# EAGLE design HshMain_v1.2 (EAGLE 7.4.0)
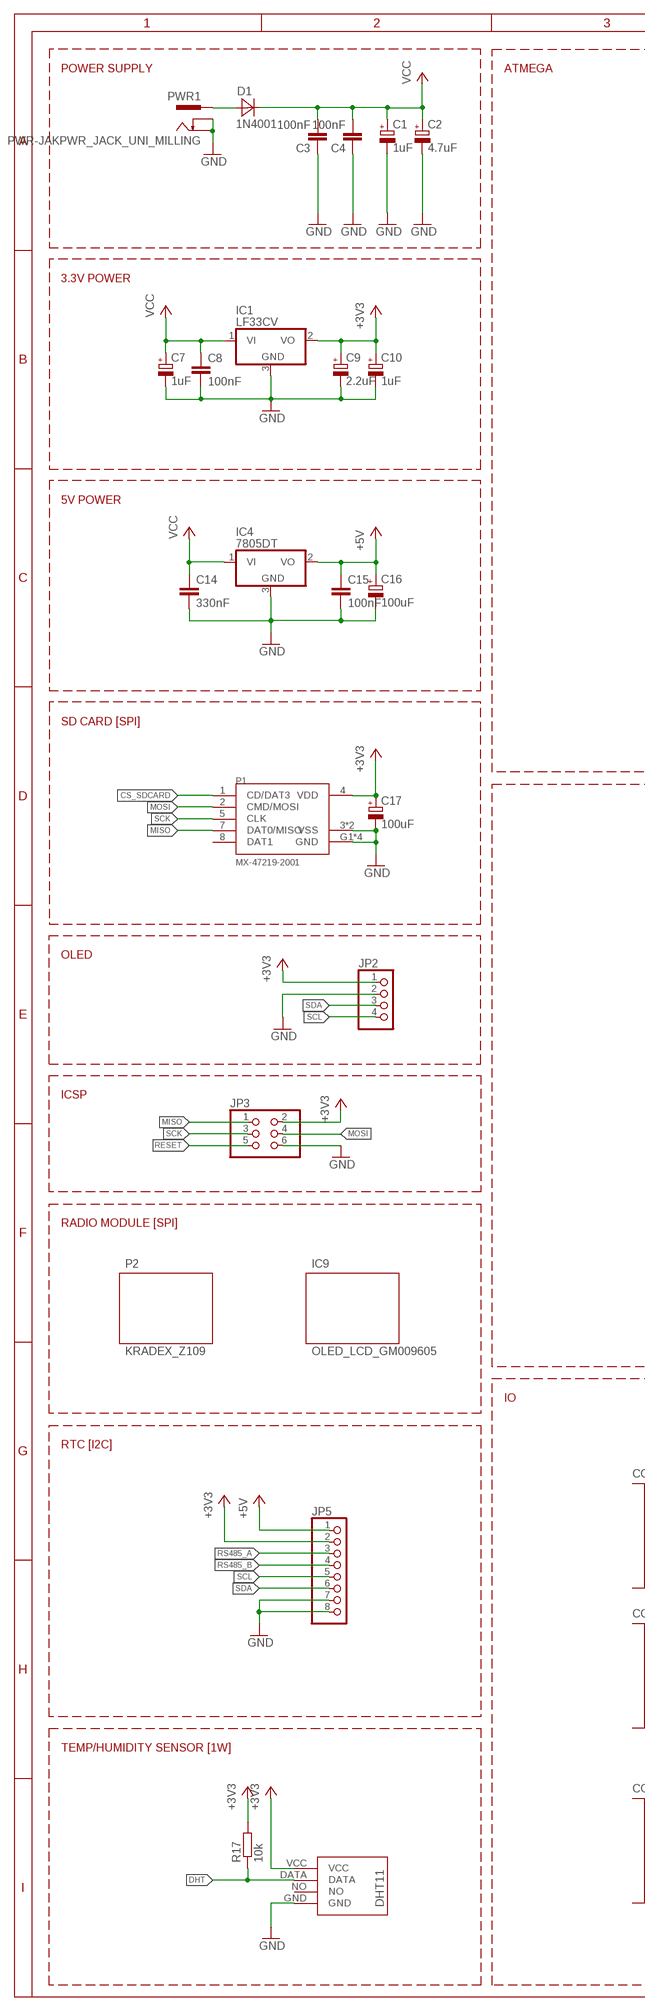
[diagram p0: schematic, sheet 1, part 1 of 2]
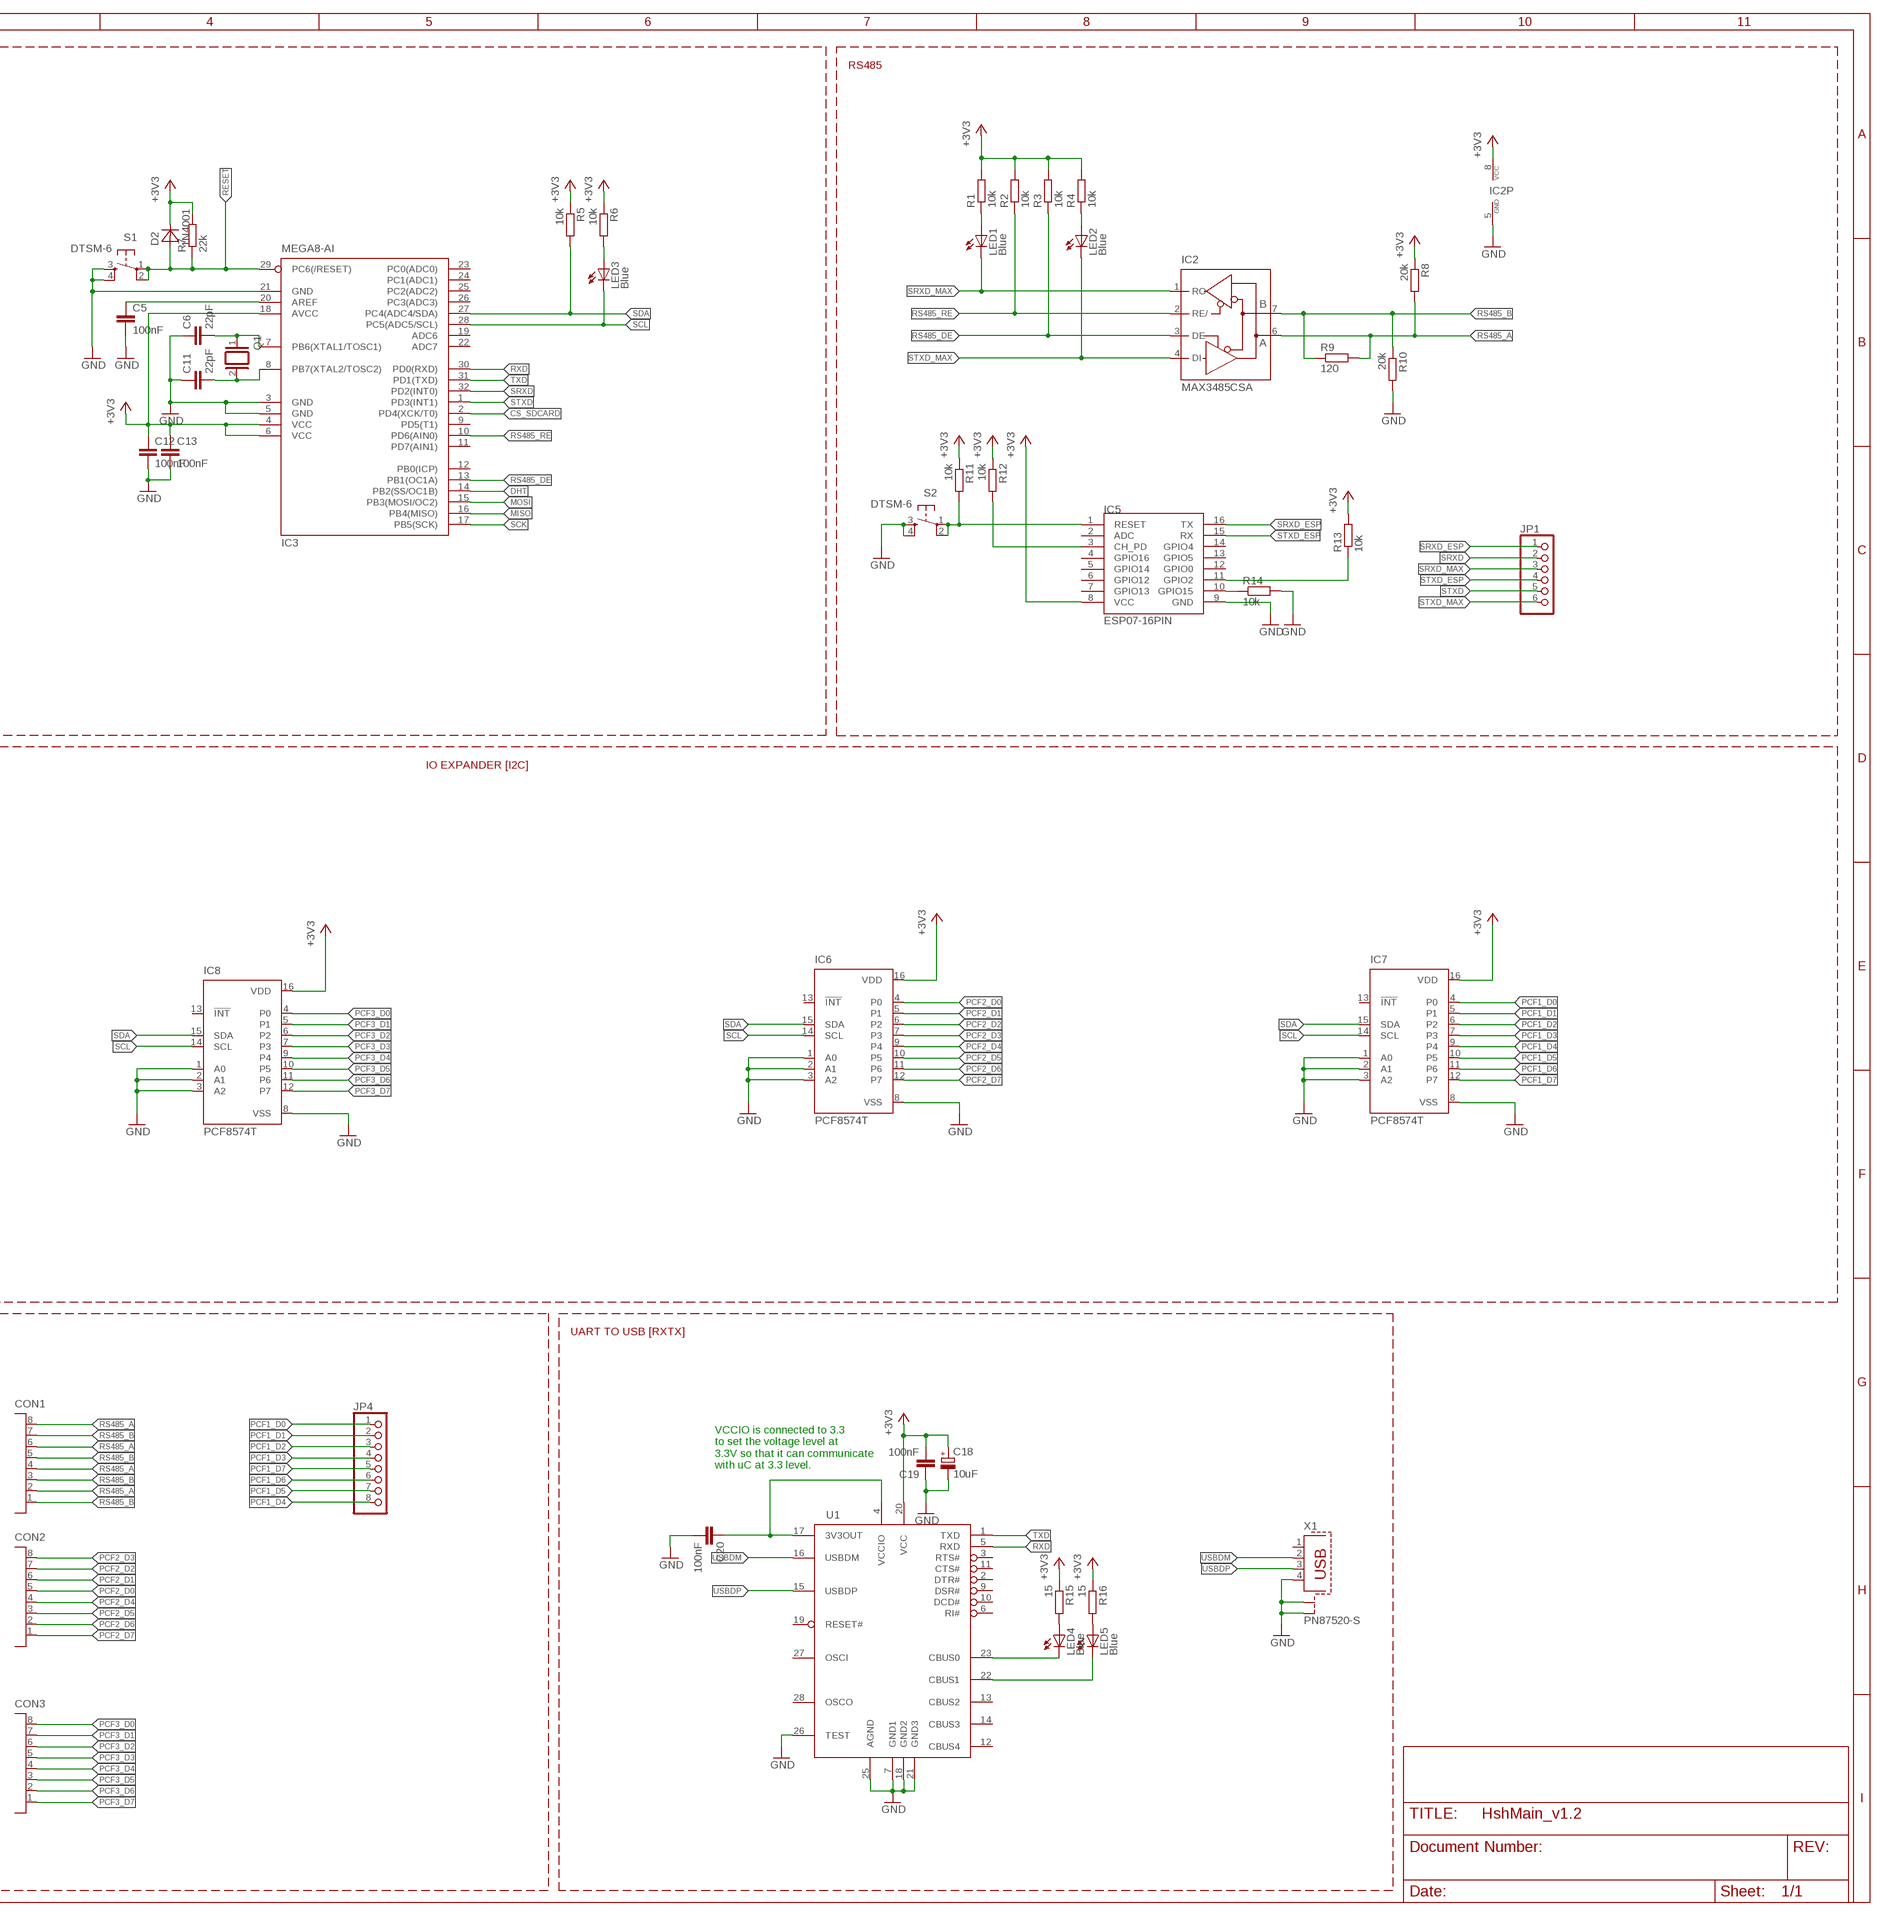
[diagram p1: schematic, sheet 1, part 2 of 2]

## Parts
C1  1uF  CPOL-EUB  [PANASONIC_B]
C2  4.7uF  CPOL-EUB  [PANASONIC_B]
C3  100nF  C-EUC0805  [C0805]
C4  100nF  C-EUC0805  [C0805]
C5  100nF  C-EUC0805  [C0805]
C6  22pF  C-EUC0805  [C0805]
C7  1uF  CPOL-EUB  [PANASONIC_B]
C8  100nF  C-EUC0805  [C0805]
C9  2.2uF  CPOL-EUB  [PANASONIC_B]
C10  1uF  CPOL-EUB  [PANASONIC_B]
C11  22pF  C-EUC0805  [C0805]
C12  100nF  C-EUC0805  [C0805]
C13  100nF  C-EUC0805  [C0805]
C14  330nF  C-EUC0805  [C0805]
C15  100nF  C-EUC0805  [C0805]
C16  100uF  CPOL-EUD  [PANASONIC_D]
C17  100uF  CPOL-EUD  [PANASONIC_D]
C18  10uF  CPOL-EUB  [PANASONIC_B]
C19  100nF  C-EUC0805  [C0805]
C20  100nF  C-EUC0805  [C0805]
CON1  15EDGRC-3.81-8P  [15EDGRC-3.81-8P]
CON2  15EDGRC-3.81-8P  [15EDGRC-3.81-8P]
CON3  15EDGRC-3.81-8P  [15EDGRC-3.81-8P]
D1  1N4001  MBRA340T3  [SMA]
D2  1N4001  MBRA340T3  [SMA]
IC1  LF33CV  78DT  [TO252]
IC2  MAX3485CSA  MAX481CSA  [SO08]
IC3  MEGA8-AI  [TQFP32-08]
IC4  7805DT  [TO252]
IC5  ESP07-16PIN  [ESP07-16PIN]
IC6  PCF8574T  [SO16W]
IC7  PCF8574T  [SO16W]
IC8  PCF8574T  [SO16W]
IC9  OLED_LCD_GM009605  [OLED_LCD_GM009605]
IC10  DHT11-PION.  [DHT11-PION.]
JP1  PINHD-1X6  [1X06]
JP2  PINHD-1X4  [1X04]
JP3  PINHD-2X3  [2X03]
JP4  PINHD-1X8  [1X08]
JP5  PINHD-1X8/90  [1X08/90]
LED1  Blue  LEDSML0805  [SML0805]
LED2  Blue  LEDSML0805  [SML0805]
LED3  Blue  LEDSML0805  [SML0805]
LED4  Blue  LEDSML0805  [SML0805]
LED5  Blue  LEDSML0805  [SML0805]
P1  MX-47219-2001  [MX-47219-2001]
P2  KRADEX_Z109  [KRADEX_Z109]
PWR1  PWR-JAKPWR_JACK_UNI_MILLING  [PWR_JACK_UNI_MILLING]
Q1  XTAL/S  [QS]
R1  10k  R-EU_R0805  [R0805]
R2  10k  R-EU_R0805  [R0805]
R3  10k  R-EU_R0805  [R0805]
R4  10k  R-EU_R0805  [R0805]
R5  10k  R-EU_R0805  [R0805]
R6  10k  R-EU_R0805  [R0805]
R7  22k  R-EU_R0805  [R0805]
R8  20k  R-EU_R0805  [R0805]
R9  120  R-EU_R0805  [R0805]
R10  20k  R-EU_R0805  [R0805]
R11  10k  R-EU_R0805  [R0805]
R12  10k  R-EU_R0805  [R0805]
R13  10k  R-EU_R0805  [R0805]
R14  10k  R-EU_R0805  [R0805]
R15  15  R-EU_R0805  [R0805]
R16  15  R-EU_R0805  [R0805]
R17  10k  R-EU_R0805  [R0805]
S1  DTSM-6  [DTSM-6]
S2  DTSM-6  [DTSM-6]
U1  FT232RL  [SSOP28DB]
X1  PN87520-S  [PN87520-S]

## Nets
+3V3: C9.+ C10.+ C12.1 C13.1 C17.+ C18.+ C19.2 D2.C IC1.2(VO) IC2.8(VCC) IC3.4(VCC) IC3.6(VCC) IC3.18(AVCC) IC5.8(VCC) IC6.16(VDD) IC7.16(VDD) IC8.16(VDD) IC10.VCC JP2.1 JP3.2 JP5.2 P1.4(VDD) R1.2 R2.2 R3.2 R4.2 R5.1 R6.1 R7.2 R8.1 R11.1 R12.1 R13.2 R15.1 R16.1 R17.2 U1.20(VCC)
+5V: C15.1 C16.+ IC4.2(VO) JP5.1
CS_SDCARD: IC3.2(PD4(XCK/T0)) P1.1(CD/DAT3)
DHT: IC3.14(PB2(SS/OC1B)) IC10.DATA R17.1
GND: C1.- C2.- C3.1 C4.1 C5.2 C6.1 C7.- C8.2 C9.- C10.- C11.1 C12.2 C13.2 C14.2 C15.2 C16.- C17.- C18.- C19.1 C20.2 IC1.3(GND) IC2.5(GND) IC3.3(GND) IC3.5(GND) IC3.21(GND) IC4.3(GND) IC5.9(GND) IC6.1(A0) IC6.2(A1) IC6.3(A2) IC6.8(VSS) IC7.1(A0) IC7.2(A1) IC7.3(A2) IC7.8(VSS) IC8.1(A0) IC8.2(A1) IC8.3(A2) IC8.8(VSS) IC10.GND JP2.2 JP3.6 JP5.7 JP5.8 P1.3(VSS) P1.6(VSS) P1.G1(GND) P1.G2(GND) P1.G3(GND) P1.G4(GND) PWR1.- PWR1.-1(-) PWR1.-2(-) PWR1.-3(-) PWR1.-4(-) PWR1.-5(-) PWR1.-6(-) PWR1.-7(-) PWR1.-8(-) PWR1.-- PWR1.--1(--) PWR1.--2(--) PWR1.--3(--) PWR1.--4(--) PWR1.--5(--) PWR1.--6(--) PWR1.--7(--) PWR1.--8(--) R10.2 R14.2 S1.3 S1.4 S2.3 S2.4 U1.7(GND1) U1.18(GND2) U1.21(GND3) U1.25(AGND) U1.26(TEST) X1.4 X1.S1 X1.S2
MISO: IC3.16(PB4(MISO)) JP3.1 P1.7(DAT0/MISO)
MOSI: IC3.15(PB3(MOSI/OC2)) JP3.4 P1.2(CMD/MOSI)
N$1: C5.1 IC3.20(AREF)
N$2: LED1.A R1.1
N$3: LED2.A R4.1
N$4: D1.A PWR1.+ PWR1.+1(+) PWR1.+2(+) PWR1.+3(+) PWR1.+4(+) PWR1.+5(+) PWR1.+6(+) PWR1.+7(+) PWR1.+8(+)
N$5: LED3.A R6.2
N$7: IC5.10(GPIO15) R14.1
N$8: IC5.11(GPIO2) R13.1
N$9: IC5.1(RESET) R11.2 S2.1 S2.2
N$12: IC5.3(CH_PD) R12.2
N$27: LED4.C U1.23(CBUS0)
N$28: LED5.C U1.22(CBUS1)
N$29: C6.2 IC3.7(PB6(XTAL1/TOSC1)) Q1.1
N$32: LED4.A R15.2
N$33: LED5.A R16.2
N$35: C11.2 IC3.8(PB7(XTAL2/TOSC2)) Q1.2
N$96: C20.1 U1.4(VCCIO) U1.17(3V3OUT)
PCF1_D0: IC7.4(P0) JP4.1
PCF1_D1: IC7.5(P1) JP4.2
PCF1_D2: IC7.6(P2) JP4.3
PCF1_D3: IC7.7(P3) JP4.4
PCF1_D4: IC7.9(P4) JP4.8
PCF1_D5: IC7.10(P5) JP4.7
PCF1_D6: IC7.11(P6) JP4.6
PCF1_D7: IC7.12(P7) JP4.5
PCF2_D0: CON2.5 IC6.4(P0)
PCF2_D1: CON2.6 IC6.5(P1)
PCF2_D2: CON2.7 IC6.6(P2)
PCF2_D3: CON2.8 IC6.7(P3)
PCF2_D4: CON2.4 IC6.9(P4)
PCF2_D5: CON2.3 IC6.10(P5)
PCF2_D6: CON2.2 IC6.11(P6)
PCF2_D7: CON2.1 IC6.12(P7)
PCF3_D0: CON3.8 IC8.4(P0)
PCF3_D1: CON3.7 IC8.5(P1)
PCF3_D2: CON3.6 IC8.6(P2)
PCF3_D3: CON3.5 IC8.7(P3)
PCF3_D4: CON3.4 IC8.9(P4)
PCF3_D5: CON3.3 IC8.10(P5)
PCF3_D6: CON3.2 IC8.11(P6)
PCF3_D7: CON3.1 IC8.12(P7)
RESET: D2.A IC3.29(PC6(/RESET)) JP3.5 R7.1 S1.1 S1.2
RS485_A: CON1.2 CON1.4 CON1.6 CON1.8 IC2.6(A) JP5.3 R8.2 R9.2
RS485_B: CON1.1 CON1.3 CON1.5 CON1.7 IC2.7(B) JP5.4 R9.1 R10.1
RS485_DE: IC2.3(DE) IC3.13(PB1(OC1A)) R3.1
RS485_RE: IC2.2(RE/) IC3.10(PD6(AIN0)) R2.1
RXD: IC3.30(PD0(RXD)) U1.5(RXD)
SCK: IC3.17(PB5(SCK)) JP3.3 P1.5(CLK)
SCL: IC3.28(PC5(ADC5/SCL)) IC6.14(SCL) IC7.14(SCL) IC8.14(SCL) JP2.4 JP5.5 LED3.C
SDA: IC3.27(PC4(ADC4/SDA)) IC6.15(SDA) IC7.15(SDA) IC8.15(SDA) JP2.3 JP5.6 R5.2
SRXD: IC3.32(PD2(INT0)) JP1.2
SRXD_ESP: IC5.16(TX) JP1.1
SRXD_MAX: IC2.1(RO) JP1.3 LED1.C
STXD: IC3.1(PD3(INT1)) JP1.5
STXD_ESP: IC5.15(RX) JP1.4
STXD_MAX: IC2.4(DI) JP1.6 LED2.C
TXD: IC3.31(PD1(TXD)) U1.1(TXD)
USBDM: U1.16(USBDM) X1.2
USBDP: U1.15(USBDP) X1.3
VCC: C1.+ C2.+ C3.2 C4.2 C7.+ C8.1 C14.1 D1.C IC1.1(VI) IC4.1(VI)
Unconnected: IC3.9(PD5(T1)) IC3.11(PD7(AIN1)) IC3.12(PB0(ICP)) IC3.19(ADC6) IC3.22(ADC7) IC3.23(PC0(ADC0)) IC3.24(PC1(ADC1)) IC3.25(PC2(ADC2)) IC3.26(PC3(ADC3)) IC5.2(ADC) IC5.4(GPIO16) IC5.5(GPIO14) IC5.6(GPIO12) IC5.7(GPIO13) IC5.12(GPIO0) IC5.13(GPIO5) IC5.14(GPIO4) IC6.13(!INT) IC7.13(!INT) IC8.13(!INT) IC10.NO P1.8(DAT1) U1.2(DTR#) U1.3(RTS#) U1.6(RI#) U1.9(DSR#) U1.10(DCD#) U1.11(CTS#) U1.12(CBUS4) U1.13(CBUS2) U1.14(CBUS3) U1.19(RESET#) U1.27(OSCI) U1.28(OSCO) X1.1

## Notes on the sheet
- POWER SUPPLY | ATMEGA | RS485
- 3.3V POWER
- 5V POWER
- SD CARD [SPI]
- IO EXPANDER [I2C]
- OLED
- ICSP
- RADIO MODULE [SPI]
- IO | UART TO USB [RXTX]
- RTC [I2C]
- VCCIO is connected to 3.3 
  to set the voltage level at 
  3.3V so that it can communicate 
  with uC at 3.3 level.
- TEMP/HUMIDITY SENSOR [1W]

## Library data of the parts
C1 C2 C7 C9 C10 C16-C18 = rcl:CPOL-EU: POLARIZED CAPACITOR, European symbol
C3-C6 C8 C11-C15 C19 C20 = rcl:C-EU: CAPACITOR, European symbol
CON1-CON3 = con-degson:15EDGRC-3.81-8P
D1 D2 = diode:MBRA340T3: Surface Mount Schottky Power Rectifier Source: http://www.onsemi.com/pub_link/Collateral/MBRA340T3-D.PDF
IC1 = hosho:78*: Positive VOLTAGE REGULATOR Source: http://cache.national.com/ds/LM/LM78L05.pdf http://www.fairchildsemi.com/ds/LM/LM7805.pdf
IC2 = maxim:MAX481CSA: RS485 TRANSEIVER; MF: MAXIM; MPN: MAX481CSA; OC_FARNELL: unknown; OC_NEWARK: 90C3817
IC3 = atmel:MEGA8: MICROCONTROLLER 8 Kbytes FLASH, 1 kbytes SRAM, 512 bytes EEPROM, USART, 6-channel 10 bit ADC, 2-channel 8 bit ADC Pin compatible with Atmega48, ATMega88, ATMega168 Source: avr.lbr; MPN: ATMEGA8-16AU; OC_FARNELL: 9171371; OC_NEWARK: 73M8863
IC4 = linear:78*: Positive VOLTAGE REGULATOR Source: http://cache.national.com/ds/LM/LM78L05.pdf http://www.fairchildsemi.com/ds/LM/LM7805.pdf
IC5 = esp8266modules:ESP07-16PIN: ESP8266 Wifi module 07 - 16 pins; DIMENSIONS: 22.0 x 16.0 mm; PINS: 16; PITCH: 0.078" / 2 mm
IC6-IC8 = micro-philips:PCF8574: I2C-Bus Remote 8-bit I/O expander http://www.semiconductors.philips.com/acrobat_download/datasheets/PCF8574_4.pdf; MPN: PCF8574T/3,512; OC_FARNELL: 1201255; OC_NEWARK: 70R6870
IC9 = hosho:OLED_LCD_GM009605
IC10 = hosho:DHT11-PION.: DHT11 Czujnik temperatury i wilgotności (widok pionowy)
JP1 = pinhead:PINHD-1X6: PIN HEADER
JP2 = pinhead:PINHD-1X4: PIN HEADER
JP3 = pinhead:PINHD-2X3: PIN HEADER
JP4 JP5 = pinhead:PINHD-1X8: PIN HEADER
LED1-LED5 = led:LED: LED OSRAM: - CHIPLED LG R971, LG N971, LY N971, LG Q971, LY Q971, LO R971, LY R971 LH N974, LH R974 LS Q976, LO Q976, LY Q976 LO Q996 - Hyper CHIPLED LW Q18S LB Q993, LB Q99A, LB R99A - SideLED LS A670, LO A670, LY A670, LG A670, LP A670 LB A673, LV A673, LT A673, LW A673 LH A674 LY A675 LS A676, LA A676, LO A676, LY A676, LW A676 LS A679, LY A679, LG A679 - Hyper Micro SIDELED® LS Y876, LA Y876, LO Y876, LY Y876 LT Y87S - SmartLED LW L88C, LW L88S LB L89C, LB L89S, LG L890 LS L89K, LO L89K, LY L89K LS L896, LA L896, LO L896, LY L896 - TOPLED LS T670, LO T670, LY T670, LG T670, LP T670 LSG T670, LSP T670, LSY T670, LOP T670, LYG T670 LG T671, LOG T671, LSG T671 LB T673, LV T673, LT T673, LW T673 LH T674 LS T676, LA T676, LO T676, LY T676, LB T676, LH T676, LSB T676, LW T676 LB T67C, LV T67C, LT T67C, LS T67K, LO T67K, LY T67K, LW E67C LS E67B, LA E67B, LO E67B, LY E67B, LB E67C, LV E67C, LT E67C LW T67C LS T679, LY T679, LG T679 LS T770, LO T770, LY T770, LG T770, LP T770 LB T773, LV T773, LT T773, LW T773 LH T774 LS E675, LA E675, LY E675, LS T675 LS T776, LA T776, LO T776, LY T776, LB T776 LHGB T686 LT T68C, LB T68C - Hyper Mini TOPLED® LB M676 - Mini TOPLED Santana® LG M470 LS M47K, LO M47K, LY M47K Source: http://www.osram.convergy.de LUXEON: - LUMILED® LXK2-PW12-R00, LXK2-PW12-S00, LXK2-PW14-U00, LXK2-PW14-V00 LXK2-PM12-R00, LXK2-PM12-S00, LXK2-PM14-U00 LXK2-PE12-Q00, LXK2-PE12-R00, LXK2-PE12-S00, LXK2-PE14-T00, LXK2-PE14-U00 LXK2-PB12-K00, LXK2-PB12-L00, LXK2-PB12-M00, LXK2-PB14-N00, LXK2-PB14-P00, LXK2-PB14-Q00 LXK2-PR12-L00, LXK2-PR12-M00, LXK2-PR14-Q00, LXK2-PR14-R00 LXK2-PD12-Q00, LXK2-PD12-R00, LXK2-PD12-S00 LXK2-PH12-R00, LXK2-PH12-S00 LXK2-PL12-P00, LXK2-PL12-Q00, LXK2-PL12-R00 Source: www.luxeon.com KINGBRIGHT: KA-3528ASYC Source: www.kingbright.com
P1 = hosho:MX-47219-2001
P2 = hosho:KRADEX_Z109
PWR1 = hosho:PWR-JAK
Q1 = special:XTAL/S: CRYSTAL
R1-R17 = rcl:R-EU_: RESISTOR, European symbol
S1 S2 = hosho:DTSM-6
U1 = ftdichip-5:FT232RL: USB UART 4th Generation USB UART (USB <-> Serial) Controller
X1 = hosho:PN87520-S; OC_FARNELL: unknown; OC_NEWARK: unknown

## Board
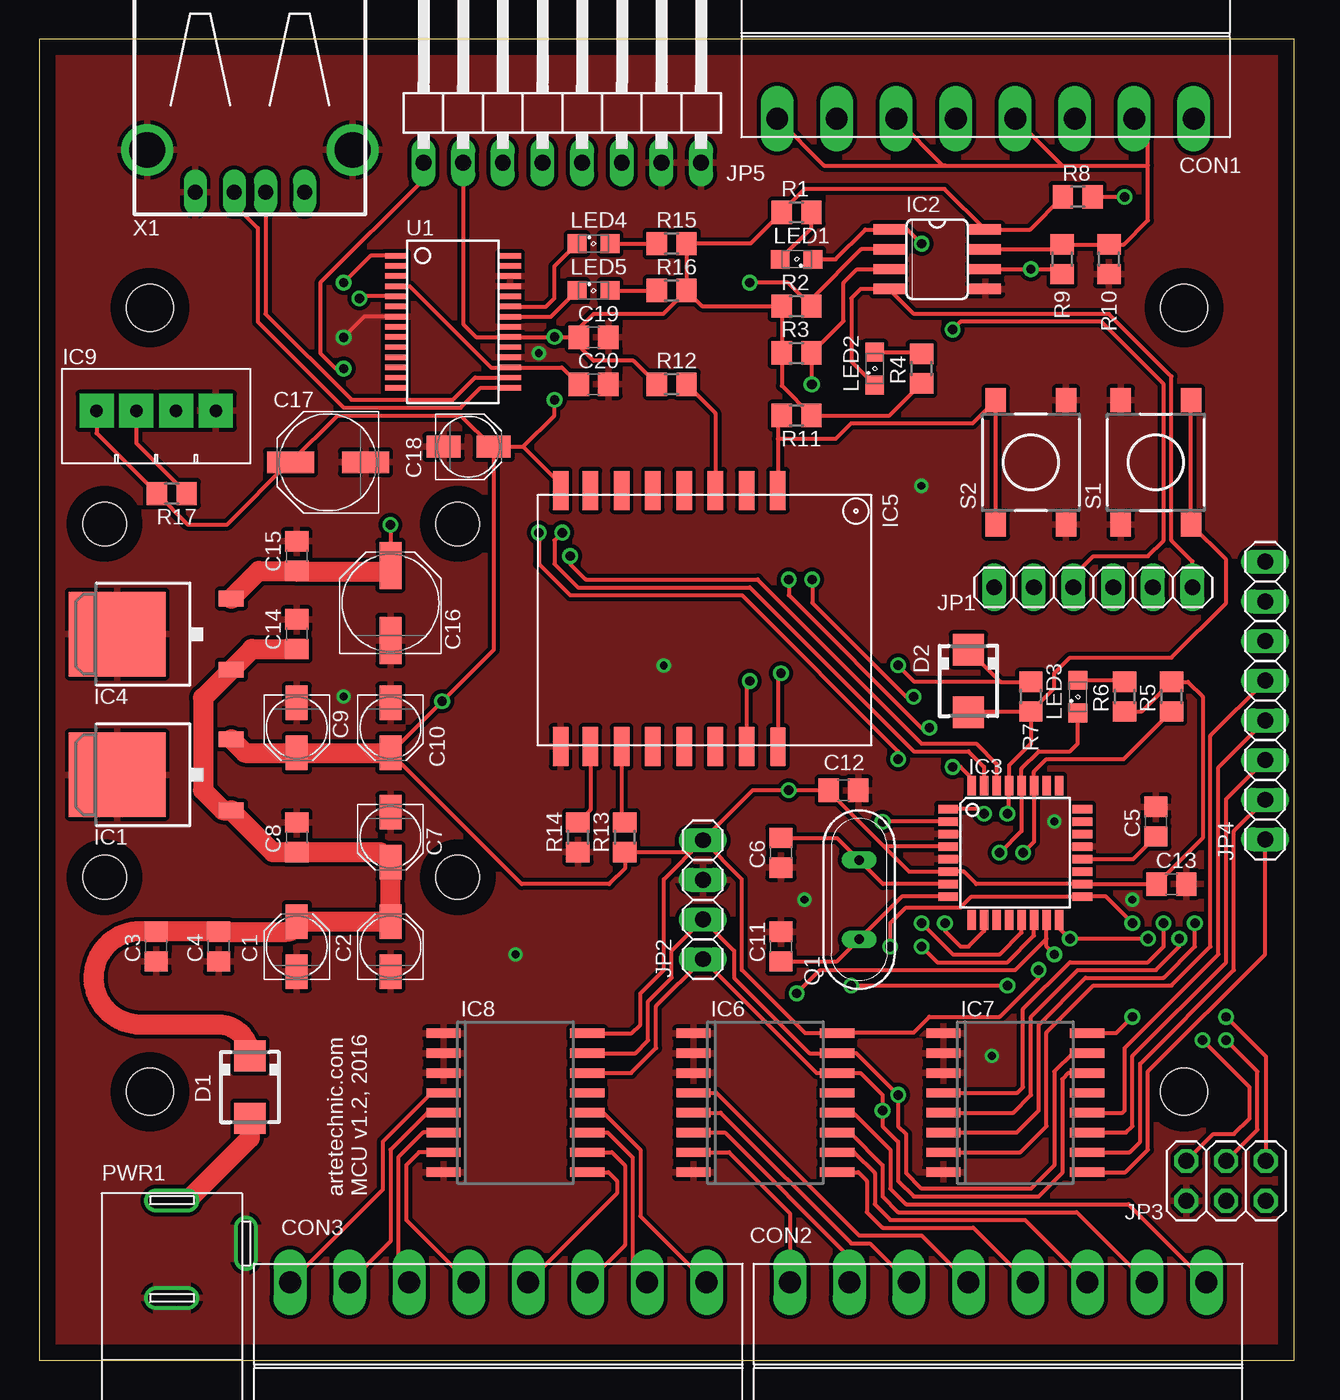
[diagram p2: board, top side]
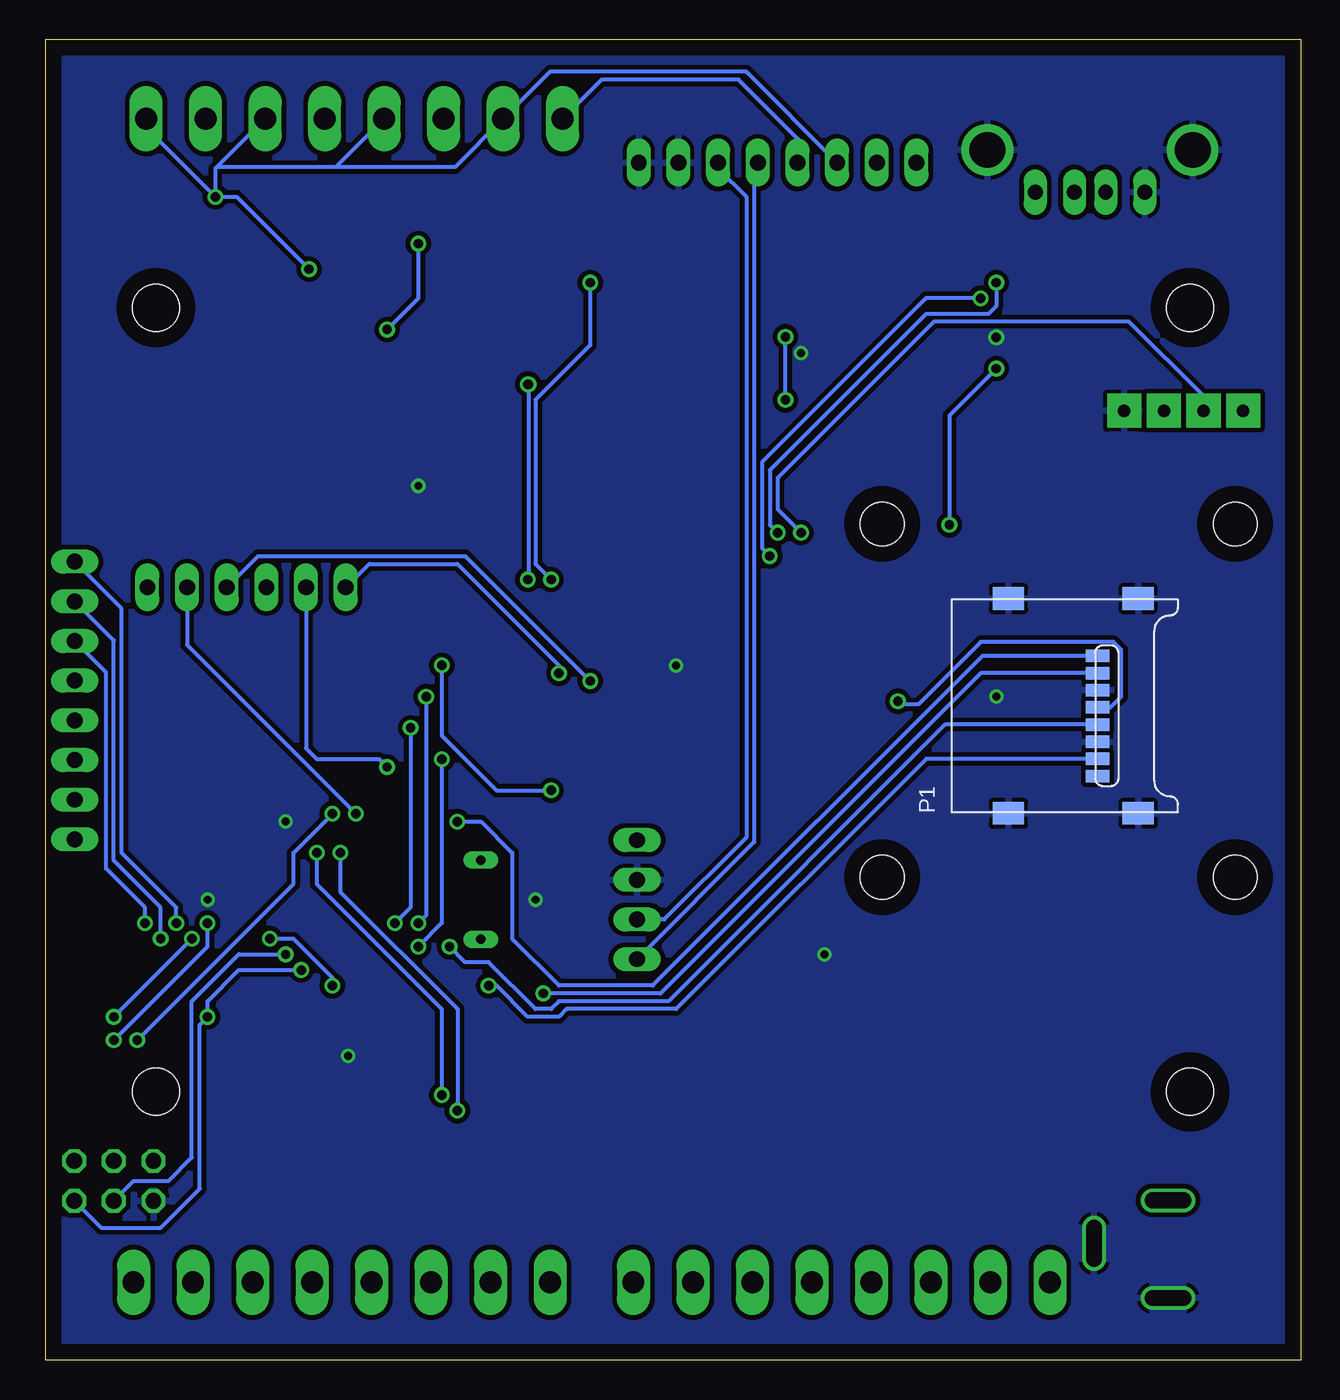
[diagram p3: board, bottom side, seen from below]

Size 80.35 x 84.6 mm. Coordinates in mm from the lower left corner, seen from the top.
Outline: 0,0 80.35,0 80.35,84.6 0,84.6 0,0
Copper layers (1*16): Top 0.035mm / dielectric 1.5mm / Bottom 0.035mm
Design rules "default": minimum track width 10mil, minimum drill 24mil, track to track 8mil, track to pad 8mil, pad to pad 8mil, via to via 8mil, smd to smd 8mil, copper to edge 40mil, drill to drill 8mil, minimum pad ring 10mil, minimum via ring 8mil, stop-mask expansion 4mil, vias tented up to drill 0mil, thermal gap 10mil
Holes 3 mm at 7.1,17.2 73.3,17.2 7.1,67.4 73.3,67.4

### Footprints (pad centres in the part's own frame; a part is rotated, then mirrored left to right if it is on the bottom)
PANASONIC_B = smd 2.2 x 1.4: + 1.6,0; - -1.6,0
C0805 = smd 1.3 x 1.5: 1 -0.95,0; 2 0.95,0
PANASONIC_D = smd 3 x 1.4: + 2.4,0; - -2.4,0
15EDGRC-3.81-8P = drill 1.4 long: 1 -15.24,0; 2 -11.43,0; 3 -7.62,0; 4 -3.81,0; 5 0,0; 6 3.81,0; 7 7.62,0; 8 11.43,0
SMA = smd 2 x 2: A 2,0; C -2,0
TO252 = smd 1 x 1.6: 1 -2.28,-4.8; 2 2.28,-4.8 | smd 5.4 x 6.2: 3 0,2.5
SO08 = smd 0.66 x 2.032: 1 -1.905,-3.073; 2 -0.635,-3.073; 3 0.635,-3.073; 4 1.905,-3.073; 5 1.905,3.073; 6 0.635,3.073; 7 -0.635,3.073; 8 -1.905,3.073
TQFP32-08 = smd 1.27 x 0.559: 1 -4.293,2.8; 2 -4.293,2; 3 -4.293,1.2; 4 -4.293,0.4; 5 -4.293,-0.4; 6 -4.293,-1.2; 7 -4.293,-2; 8 -4.293,-2.8; 17 4.293,-2.8; 18 4.293,-2; 19 4.293,-1.2; 20 4.293,-0.4; 21 4.293,0.4; 22 4.293,1.2; 23 4.293,2; 24 4.293,2.8 | smd 0.559 x 1.27: 9 -2.8,-4.293; 10 -2,-4.293; 11 -1.2,-4.293; 12 -0.4,-4.293; 13 0.4,-4.293; 14 1.2,-4.293; 15 2,-4.293; 16 2.8,-4.293; 25 2.8,4.293; 26 2,4.293; 27 1.2,4.293; 28 0.4,4.293; 29 -0.4,4.293; 30 -1.2,4.293; 31 -2,4.293; 32 -2.8,4.293
ESP07-16PIN = smd 2.5 x 1: 1 -8.2,5.8; 2 -8.2,3.8; 3 -8.2,1.8; 4 -8.2,-0.2; 5 -8.2,-2.2; 6 -8.2,-4.2; 7 -8.2,-6.2; 8 -8.2,-8.105; 9 8.2,-8.105; 10 8.2,-6.2; 11 8.2,-4.2; 12 8.2,-2.2; 13 8.2,-0.2; 14 8.2,1.8; 15 8.2,3.8; 16 8.2,5.8
SO16W = smd 0.6 x 2.2: 1 -4.445,-4.6; 2 -3.175,-4.6; 3 -1.905,-4.6; 4 -0.635,-4.6; 5 0.635,-4.6; 6 1.905,-4.6; 7 3.175,-4.6; 8 4.445,-4.6; 9 4.445,4.6; 10 3.175,4.6; 11 1.905,4.6; 12 0.635,4.6; 13 -0.635,4.6; 14 -1.905,4.6; 15 -3.175,4.6; 16 -4.445,4.6
OLED_LCD_GM009605 = hole 2.8: -11.3,-11.3; -11.3,11.3; 11.3,11.3; 11.3,-11.3
DHT11-PION. = drill 0.8 pad 2.184 square: DATA -1.27,0.305; GND 3.81,0.305; NO 1.27,0.305; VCC -3.81,0.305
1X06 = drill 1.016 long: 1 -6.35,0; 2 -3.81,0; 3 -1.27,0; 4 1.27,0; 5 3.81,0; 6 6.35,0
1X04 = drill 1.016 long: 1 -3.81,0; 2 -1.27,0; 3 1.27,0; 4 3.81,0
2X03 = drill 1.016 octagon: 1 -2.54,-1.27; 2 -2.54,1.27; 3 0,-1.27; 4 0,1.27; 5 2.54,-1.27; 6 2.54,1.27
1X08 = drill 1.016 long: 1 -8.89,0; 2 -6.35,0; 3 -3.81,0; 4 -1.27,0; 5 1.27,0; 6 3.81,0; 7 6.35,0; 8 8.89,0
1X08/90 = drill 1.016 long: 1 -8.89,-3.81; 2 -6.35,-3.81; 3 -3.81,-3.81; 4 -1.27,-3.81; 5 1.27,-3.81; 6 3.81,-3.81; 7 6.35,-3.81; 8 8.89,-3.81
SML0805 = smd 1.2 x 1.2: A 1.05,0; C -1.05,0
MX-47219-2001 = smd 0.8 x 1.5: 1 10.08,2.6; 2 8.98,2.6; 3 7.88,2.6; 4 6.78,2.6; 5 5.68,2.6; 6 4.58,2.6; 7 3.48,2.6; 8 2.38,2.6 | smd 1.45 x 2: G1 13.75,0; G2 13.75,8.3; G3 0,8.3; G4 0,0
PWR_JACK_UNI_MILLING = drill 1: + -6.25,0; +1 -6.25,0.25; +2 -6.25,0.5; +3 -6.25,0.75; +4 -6.25,1; +5 -6.25,-0.25; +6 -6.25,-0.5; +7 -6.25,-0.75; +8 -6.25,-1; - 0,0; -1 0,0.25; -2 0,0.5; -3 0,0.75; -4 0,1; -5 0,-0.25; -6 0,-0.5; -7 0,-0.75; -8 0,-1; -- -3.5,4.75; --1 -3.75,4.75; --2 -4,4.75; --3 -4.25,4.75; --4 -4.5,4.75; --5 -3.25,4.75; --6 -3,4.75; --7 -2.75,4.75; --8 -2.5,4.75
QS = drill 0.61 long: 1 -2.54,0; 2 2.54,0
R0805 = smd 1.3 x 1.5: 1 -0.95,0; 2 0.95,0
DTSM-6 = smd 1.55 x 1.3: 1 -3.975,2.25; 2 3.975,2.25; 3 -3.975,-2.25; 4 3.975,-2.25
SSOP28DB = smd 0.348 x 1.397: 1 -4.225,-3.656; 2 -3.575,-3.656; 3 -2.925,-3.656; 4 -2.275,-3.656; 5 -1.625,-3.656; 6 -0.975,-3.656; 7 -0.325,-3.656; 8 0.325,-3.656; 9 0.975,-3.656; 10 1.625,-3.656; 11 2.275,-3.656; 12 2.925,-3.656; 13 3.575,-3.656; 14 4.225,-3.656; 15 4.225,3.656; 16 3.575,3.656; 17 2.925,3.656; 18 2.275,3.656; 19 1.625,3.656; 20 0.975,3.656; 21 0.325,3.656; 22 -0.325,3.656; 23 -0.975,3.656; 24 -1.625,3.656; 25 -2.275,3.656; 26 -2.925,3.656; 27 -3.575,3.656; 28 -4.225,3.656
PN87520-S = drill 0.95 long: 1 -3.5,2.71; 2 -1,2.71; 3 1,2.71; 4 3.5,2.71 | drill 2.3 pad 2.9: S1 -6.57,0; S2 6.57,0

### Placement (x,y rotation side)
C1  16.5,26.5 90 top
C2  22.5,26.5 90 top
C3  7.5,26.5 90 top
C4  11.5,26.5 90 top
C5  71.5,34.5 90 top
C6  47.5,32.5 90 top
C7  22.5,33.5 270 top
C8  16.5,33.5 90 top
C9  16.5,40.5 270 top
C10  22.5,40.5 270 top
C11  47.5,26.5 270 top
C12  51.5,36.5 0 top
C13  72.5,30.5 0 top
C14  16.5,46.5 90 top
C15  16.5,51.5 90 top
C16  22.5,48.5 90 top
C17  18.5,57.5 180 top
C18  27.5,58.5 0 top
C19  35.5,65.5 180 top
C20  35.5,62.5 0 top
CON1  62.5,79.5 0 top
CON2  59.5,5 180 top
CON3  27.5,5 180 top
D1  13.5,17.5 270 top
D2  59.5,43.5 270 top
IC1  7.5,37.5 90 top
IC2  57.5,70.5 270 top
IC3  62.5,32.5 0 top
IC4  7.5,46.5 90 top
IC5  41.5,47.5 270 top
IC6  46.5,16.5 270 top
IC7  62.5,16.5 270 top
IC8  30.5,16.5 270 top
IC9  15.5,42.25 0 top
IC10  7.5,60.5 0 top
JP1  67.5,49.5 0 top
JP2  42.5,29.5 270 top
JP3  76,11.5 180 top
JP4  78.5,42.25 270 top
JP5  33.5,80.5 0 top
LED1  48.5,70.5 180 top
LED2  53.5,63.5 90 top
LED3  66.5,42.5 90 top
LED4  35.5,71.5 0 top
LED5  35.5,68.5 0 top
P1  10.42,35.03 90 bottom
P2  -3.55,-2.7 0 top  (outside the outline)
PWR1  8.5,4 270 top
Q1  52.5,29.5 270 top
R1  48.5,73.5 180 top
R2  48.5,67.5 180 top
R3  48.5,64.5 180 top
R4  56.5,63.5 270 top
R5  72.5,42.5 270 top
R6  69.5,42.5 90 top
R7  63.5,42.5 90 top
R8  66.5,74.5 0 top
R9  65.5,70.5 270 top
R10  68.5,70.5 270 top
R11  48.5,60.5 180 top
R12  40.5,62.5 0 top
R13  37.5,33.5 270 top
R14  34.5,33.5 270 top
R15  40.5,71.5 180 top
R16  40.5,68.5 180 top
R17  8.5,55.5 180 top
S1  71.5,57.5 270 top
S2  63.5,57.5 90 top
U1  26.5,66.5 270 top
X1  13.5,77.5 180 top

### Tracks (layer width: path | path; a pad name or v marks a point on that pad's centre or on a via)
+3V3  (via drill 0.6)
  Top 0.254: 54.1,32.9 55.7,31.3 IC3.6 59.2,31.3 60,30.5 IC3.18 C13.1 74.5,33.45 74.5,42.5 73.55,43.45 R5.1 70.6,41.55 R6.1 | IC3.4 54.1,32.9 | C19.2 34.52,65.53 v33,65.53 U1.20 27.98,65.53 27.15,66.35 JP5.2 | R12.1 38.05,64 35.5,64 34.5,65 34.5,65.45 C19.2 | R16.1 R15.1 45.55,71.5 R1.2 47.55,73.55 49,75 57.98,75 IC2.8 63.45,72.41 R8.1 | R4.2 54.45,60.5 R11.1 47.55,62.4 R3.2 R2.2 42.45,67.5 R16.1 | v70,22 68.94,20.95 IC7.16 | IC8.16 37.95,20.95 38.5,21.5 38.5,23.5 40,25 40,30.81 JP2.1 | JP2.1 41.74,32.55 R13.2 37.5,31.5 36.5,30.5 30.9,30.5 C10.+ v25.8,42.2 29.1,45.5 C18.+ | R16.1 39.95,67 35.5,67 34.55,66.05 C19.2 | JP2.1 45,30.81 45,25 49.05,20.95 IC6.16 51.16,21 56,21 57,22 61.5,22 64,24.5 v64,25 | C18.+ 31,58.5 | 31,58.5 33,60.5 v33,61.5 | D2.C 61.55,43.45 | 61.55,43.45 R7.2 | C18.+ 29,58.5 27,60.5 19.1,60.5 C17.+ 16,57.5 12,53.5 9.55,53.5 R17.2 3.69,59.36 IC10.VCC | IC5.8 33.4,56.1 31,58.5 | JP2.1 45.69,36.5 v48,36.5 C12.1 50.55,36.45 54.1,32.9 | 61.55,43.45 56.05,43.45 v55,44.5
  Top 1.27: C10.+ C9.+ 13.18,38.9 IC1.2
  Bottom 0.254: JP3.2 76.81,8.5 73,8.5 70.5,11 70.5,21.5 v70,22 70,23 68,25 v64,25 | v33,61.5 v33,65.53 | v55,44.5 55,40 51.5,36.5 v48,36.5 | P1.4 12.19,41.81 11.5,42.5 11.5,45.5 12,46 20.5,46 24.5,42 25.6,42 v25.8,42.2
+5V  (via drill 0.6)
  Top 0.254: JP5.1 24.61,75.61 18,69 18,64.5 19,63.5 v19.5,63.5 | v22.5,53.5 C16.+
  Top 1.27: IC4.2 14.07,50.55 C15.1 16.55,50.5 22.5,50.5 C16.+
  Bottom 0.254: v19.5,63.5 22.5,60.5 v22.5,53.5
CS_SDCARD  (via drill 0.6)
  Top 0.254: IC3.2 v54,34.5
  Bottom 0.254: P1.1 20.39,45.11 41.5,24 47.5,24 50.5,27 50.5,32.5 52.5,34.5 v54,34.5
DHT  (via drill 0.6)
  Top 0.254: IC10.DATA 6.23,58.72 R17.1 | v32,53 32,51 34,49 45,49 55,39 v55,38.5 | IC3.14 63.7,27.2 62,25.5 57.5,25.5 v56.5,26.5
  Bottom 0.254: IC10.DATA 6.23,61.73 11,66.5 23.5,66.5 33.5,56.5 33.5,54.5 v32,53 | v55,38.5 55,28 v56.5,26.5
GND  (via drill 0.5, 0.6)
  Top 0.254: U1.7 20.82,66.83 v19.5,65.5
  other vias: 61,19.5 65,34.5 49,29.5 30.5,26 40,44.5 56.5,56 19.5,42.5 70,29.5 32,64.5
  pour Bottom (isolate 0.305): -1.5,85.5 81.5,85.5 81.5,-1.5 -1.5,-1.5
  pour Top (isolate 0.254): -1.5,85.5 81.5,85.5 81.5,-1.5 -1.5,-1.5
MISO  (via drill 0.6)
  Top 0.254: v71,27 v66,27 65.3,27.7 IC3.16 | v76,22 78.54,19.46 JP3.1 | v52,24 v62,24
  Bottom 0.254: v76,22 v71,27 | P1.7 23.99,38.51 40,22.5 47,22.5 47.5,22 49.5,22 51.5,24 v52,24 | v62,24 62,24.5 64.5,27 v66,27
MOSI  (via drill 0.6)
  Top 0.254: v65,26 64.5,26.5 64.5,27 | 64.5,27 IC3.15 | v48.5,23.5 50,25 62.5,25 64.5,27
  Bottom 0.254: JP3.4 74.73,11.5 72.5,11.5 71,13 71,23 68,26 v65,26 | P1.2 20.49,44.01 41,23.5 v48.5,23.5
N$1
  Top 0.254: IC3.20 70.05,32.1 C5.1
N$2
  Top 0.254: LED1.A 49.45,72.5 R1.1
N$3
  Top 0.254: LED2.A 56.4,64.55 R4.1
N$4
  Top 1.27: D1.A 13.5,14.25 PWR1.+4 PWR1.+3 PWR1.+2 PWR1.+1 PWR1.+ PWR1.+5 PWR1.+6 PWR1.+7 PWR1.+8
N$5
  Top 0.254: LED3.A 69.4,43.55 R6.2
N$7
  Top 0.254: IC5.10 35.3,35.25 R14.1
N$8
  Top 0.254: IC5.11 37.3,34.65 R13.1
N$9
  Top 0.254: R11.2 47.3,60.25 47.3,59 | 47.3,59 IC5.1 | 47.3,59 51,59 52,60 59.77,60 S2.2 S2.1
N$12
  Top 0.254: R12.2 43.3,60.65 IC5.3
N$27
  Top 0.254: U1.23 32.48,67.47 33,68 33,70.05 LED4.C
N$28
  Top 0.254: U1.22 32.77,66.83 LED5.C
N$29
  Top 0.254: IC3.7 54.04,30.5 Q1.1 51.09,33.45 C6.2
N$32
  Top 0.254: LED4.A R15.2
N$33
  Top 0.254: LED5.A R16.2
N$35
  Top 0.254: IC3.8 55.24,29.7 Q1.2 51.09,25.55 C11.2
N$96
  Top 0.254: C20.1 33.48,63.58 U1.17 28.93,63.58 23.73,68.78 U1.4
PCF1_D0  (via drill 0.6)
  Top 0.254: IC7.4 62.63,17.14 63,17.5 63,22.5 66,25.5 71,25.5 72,26.5 v72,28
  Bottom 0.254: v72,28 72,29 75.5,32.5 75.5,48.14 JP4.1
PCF1_D1  (via drill 0.6)
  Top 0.254: IC7.5 62.37,15.86 63.5,17 63.5,22 66.5,25 71.5,25 73,26.5 v73,27
  Bottom 0.254: v73,27 73,29 76,32 76,46.1 JP4.2
PCF1_D2  (via drill 0.6)
  Top 0.254: IC7.6 62.59,14.6 64,16 64,21.5 67,24.5 72,24.5 74,26.5 v74,28
  Bottom 0.254: v74,28 74,29 76.5,31.5 76.5,44.06 JP4.3
PCF1_D3
  Top 0.254: IC7.7 62.83,13.32 64.5,15 64.5,21 67.5,24 72.5,24 75,26.5 75,40 78.5,43.5 JP4.4
PCF1_D4
  Top 0.254: IC7.9 69.56,12.05 71,13.5 71,18.5 78.5,26 JP4.8
PCF1_D5
  Top 0.254: IC7.10 69.83,13.32 70.5,14 70.5,19 76.5,25 76.5,33.9 JP4.7
PCF1_D6
  Top 0.254: IC7.11 69.59,14.6 70,15 70,19.5 76,25.5 76,35.94 JP4.6
PCF1_D7
  Top 0.254: IC7.12 69.36,15.86 69.5,16 69.5,20 75.5,26 75.5,37.98 JP4.5
PCF2_D0
  Top 0.254: IC6.4 43.37,17.14 52.5,8 56.5,8 CON2.5
PCF2_D1
  Top 0.254: IC6.5 43.63,15.86 52,7.5 53.19,7.5 CON2.6
PCF2_D2
  Top 0.254: IC6.6 43.91,14.6 51.88,6.62 CON2.7
PCF2_D3
  Top 0.254: IC6.7 44.17,13.32 48.07,9.43 CON2.8
PCF2_D4
  Top 0.254: CON2.4 59.81,8.5 54,8.5 53,9.5 53,11.5 52.45,12.05 IC6.9
PCF2_D5
  Top 0.254: CON2.3 63.12,9 57,9 56.5,9 54.5,9 53.5,10 53.5,12 52.17,13.32 IC6.10
PCF2_D6
  Top 0.254: CON2.2 66.43,9.5 55,9.5 54,10.5 54,12.5 51.91,14.6 IC6.11
PCF2_D7
  Top 0.254: CON2.1 69.74,10 55.5,10 54.5,11 54.5,13.5 52.13,15.86 IC6.12
PCF3_D0
  Top 0.254: IC8.4 25.14,17.14 22,14 22,10.93 CON3.8
PCF3_D1
  Top 0.254: IC8.5 24.86,15.86 22.5,13.5 22.5,7.62 CON3.7
PCF3_D2
  Top 0.254: IC8.6 24.59,14.6 23,13 23,5.69 CON3.6
PCF3_D3
  Top 0.254: IC8.7 24.32,13.32 23.5,12.5 23.5,9 CON3.5
PCF3_D4
  Top 0.254: IC8.9 36.45,12.05 37,11.5 37,10.69 CON3.4
PCF3_D5
  Top 0.254: IC8.10 36.67,13.32 37.5,12.5 37.5,7.38 CON3.3
PCF3_D6
  Top 0.254: IC8.11 36.41,14.6 38,13 38,5.93 CON3.2
PCF3_D7
  Top 0.254: IC8.12 36.13,15.86 38.5,13.5 38.5,9.24 CON3.1
RESET  (via drill 0.6)
  Top 0.254: R7.1 63.5,39.5 62.1,38.1 IC3.29 62.1,35.1 v62,35 | JP3.5 75.19,14.5 76.5,14.5 77.5,15.5 77.5,17.5 v74.5,20.5 | D2.A 59.55,41.55 R7.1 | R7.1 65,43.05 65,44 66,45 72.5,45 76,48.5 76,51.27 S1.2 S1.1
  Bottom 0.254: v74.5,20.5 64.5,30.5 64.5,32.5 v62,35
RS485_A  (via drill 0.6)
  Top 0.254: IC2.6 v63.5,69.86 65.19,69.86 R9.2 | R8.2 v69.5,74.5
  Bottom 0.254: JP5.3 35.5,82.5 48.07,82.5 CON1.2 54.16,76.41 61.78,76.41 | v69.5,74.5 68.14,74.5 v63.5,69.86 | v69.5,74.5 73.93,78.93 CON1.8 | CON1.6 69.41,76.41 | 69.41,76.41 69.5,76.31 v69.5,74.5 | CON1.4 61.78,76.41 | 61.78,76.41 62,76.41 69.41,76.41
RS485_B
  Top 0.254: IC2.7 65.19,71.14 R9.1 R10.1 69.45,71.45 71,73 71,76.5 | 71,76.5 71,78.62 CON1.7 | CON1.5 65.5,76.5 | 65.5,76.5 71,76.5 | CON1.3 57.88,76.5 | 57.88,76.5 58,76.5 65.5,76.5 | CON1.1 50.26,76.5 57.88,76.5
  Bottom 0.254: JP5.4 32.23,78.23 36,82 44.76,82 CON1.1
RS485_DE  (via drill 0.6)
  Top 0.254: IC2.3 52.37,69.86 51.5,69 51.5,66.55 R3.1 v49.45,62.5 v49.5,62.5 | v49.5,50 49.5,48.5 55.5,42.5 v56,42.5 | v56.5,28 58.5,26 61.5,26 62.9,27.4 IC3.13
  Bottom 0.254: v49.45,62.5 49.45,50.05 v49.5,50 | v56,42.5 56,28.5 v56.5,28
RS485_RE  (via drill 0.6)
  Top 0.254: IC2.2 52.63,71.14 49.5,68 49.5,67.55 R2.1 47.95,69 v45.5,69 | v48,50 48,49 56.5,40.5 v57,40.5 | v58,28 58,27.5 59,26.5 59.5,26.5 60.5,27.5 IC3.10
  Bottom 0.254: v45.5,69 45.5,65 49,61.5 49,51 v48,50 | v57,40.5 57,29 v58,28
RXD  (via drill 0.6)
  Top 0.254: U1.5 20.62,68.12 v20.5,68 | v34,51.5 34,51 35,50 46,50 56.5,39.5 60,39.5 61.3,38.2 IC3.30
  Bottom 0.254: v20.5,68 24,68 34.5,57.5 34.5,52 v34,51.5
SCK  (via drill 0.6)
  Top 0.254: JP3.3 78,14.77 78,18.5 v76,20.5 | v70,28 68.3,29.7 IC3.17 59.7,29.7 59,29 55.5,29 54.5,28 v54.5,26.5
  Bottom 0.254: v76,20.5 70,26.5 v70,28 | P1.5 22.79,40.71 40.5,23 47.5,23 48,22.5 49,22.5 52,25.5 53.5,25.5 v54.5,26.5
SCL  (via drill 0.6)
  Top 0.254: LED3.C 66.5,39.5 66,39 64,39 62.9,37.9 IC3.28 62.9,33.9 v61.5,32.5 | IC7.14 65.91,18.41 65.5,18 65.5,12 64,10.5 56,10.5 55,11.5 55,14 54,15 v54,16 54,17 52.59,18.41 IC6.14 49.78,18.41 JP2.4 39.5,22.69 39.5,20 37.91,18.41 IC8.14
  Bottom 0.254: JP5.5 34.81,76.69 35,76.5 35,33.19 JP2.4 | v61.5,32.5 61.5,30 54,22.5 v54,16
SDA  (via drill 0.6)
  Top 0.254: R5.2 69.45,38.5 64.5,38.5 63.7,37.7 IC3.27 63.7,33.2 v63,32.5 | IC7.15 66.17,19.68 65,18.5 65,12.5 63.5,11 56.5,11 55.5,12 55.5,14.5 55,15 v55,17 52.33,19.68 IC6.15 49.33,19.68 44.5,24.5 44.5,26.23 JP2.3 40.5,26.23 40.5,24.5 39,23 39,20.5 38.17,19.68 IC8.15
  Bottom 0.254: JP5.6 37.31,76.31 35.5,74.5 35.5,33.5 40.77,28.23 JP2.3 | v63,32.5 63,30.5 55,22.5 v55,17
SRXD  (via drill 0.6)
  Top 0.254: v58.5,38 59,38 59.7,37.3 IC3.32
  Bottom 0.254: JP1.2 63.69,39.19 63,38.5 59,38.5 v58.5,38
SRXD_ESP  (via drill 0.6)
  Top 0.254: v47.5,44 47.3,43.8 IC5.16
  Bottom 0.254: JP1.1 59.65,51 54,51 47.5,44.5 v47.5,44
SRXD_MAX  (via drill 0.6)
  Top 0.254: LED1.C 51,70.5 52.91,72.41 IC2.1 55.59,72.41 v56.5,71.5 | JP1.3 66.23,50.23 67.5,51.5 71,51.5 72,52.5 72,62.5 68,66.5 59,66.5 v58.5,66
  Bottom 0.254: v58.5,66 56.5,68 v56.5,71.5
STXD  (via drill 0.6)
  Top 0.254: v60.5,35 60.2,35.3 IC3.1
  Bottom 0.254: JP1.5 71.31,45.81 v60.5,35
STXD_ESP  (via drill 0.6)
  Top 0.254: v45.5,43.5 45.3,43.3 IC5.15
  Bottom 0.254: JP1.4 66.77,51.5 53.5,51.5 v45.5,43.5
STXD_MAX
  Top 0.254: LED2.C 52,63.95 52,68 52.59,68.59 IC2.4 56.02,67 68.5,67 72.5,63 72.5,52.5 73.85,51.15 JP1.6
TXD  (via drill 0.6)
  Top 0.254: U1.1 21.23,70.72 v19.5,69 | v33.5,53 33,52.5 33,51 34.5,49.5 45.5,49.5 56,39 59.5,39 60.5,38 IC3.31
  Bottom 0.254: v19.5,69 19.5,67.5 20,67 24,67 34,57 34,53.5 v33.5,53
USBDM
  Top 0.254: X1.2 14.5,67 20,61.5 26.5,61.5 27.93,62.92 U1.16
USBDP
  Top 0.254: X1.3 12.5,74 14,72.5 14,66.5 19.5,61 27,61 28.27,62.27 U1.15
VCC
  Top 0.254: 6.5,27.5 7.45,27.5 C3.2
  Top 1.27: D1.C arc90 11.5,21.5 6.5,21.5 arc-90 3.5,24.5 arc-90 6.5,27.5 11.45,27.5 arc-90 C4.2 15.85,27.45 arc90 C1.+ C2.+ C7.+ 21.85,32.55 C8.1 14.97,32.55 IC1.1 11.78,35.22 10.5,36.5 10.5,42.42 IC4.1 13.63,45.55 C14.1

### Text on the board
tPlace: artetechnic.com / MCU v1.2, 2016